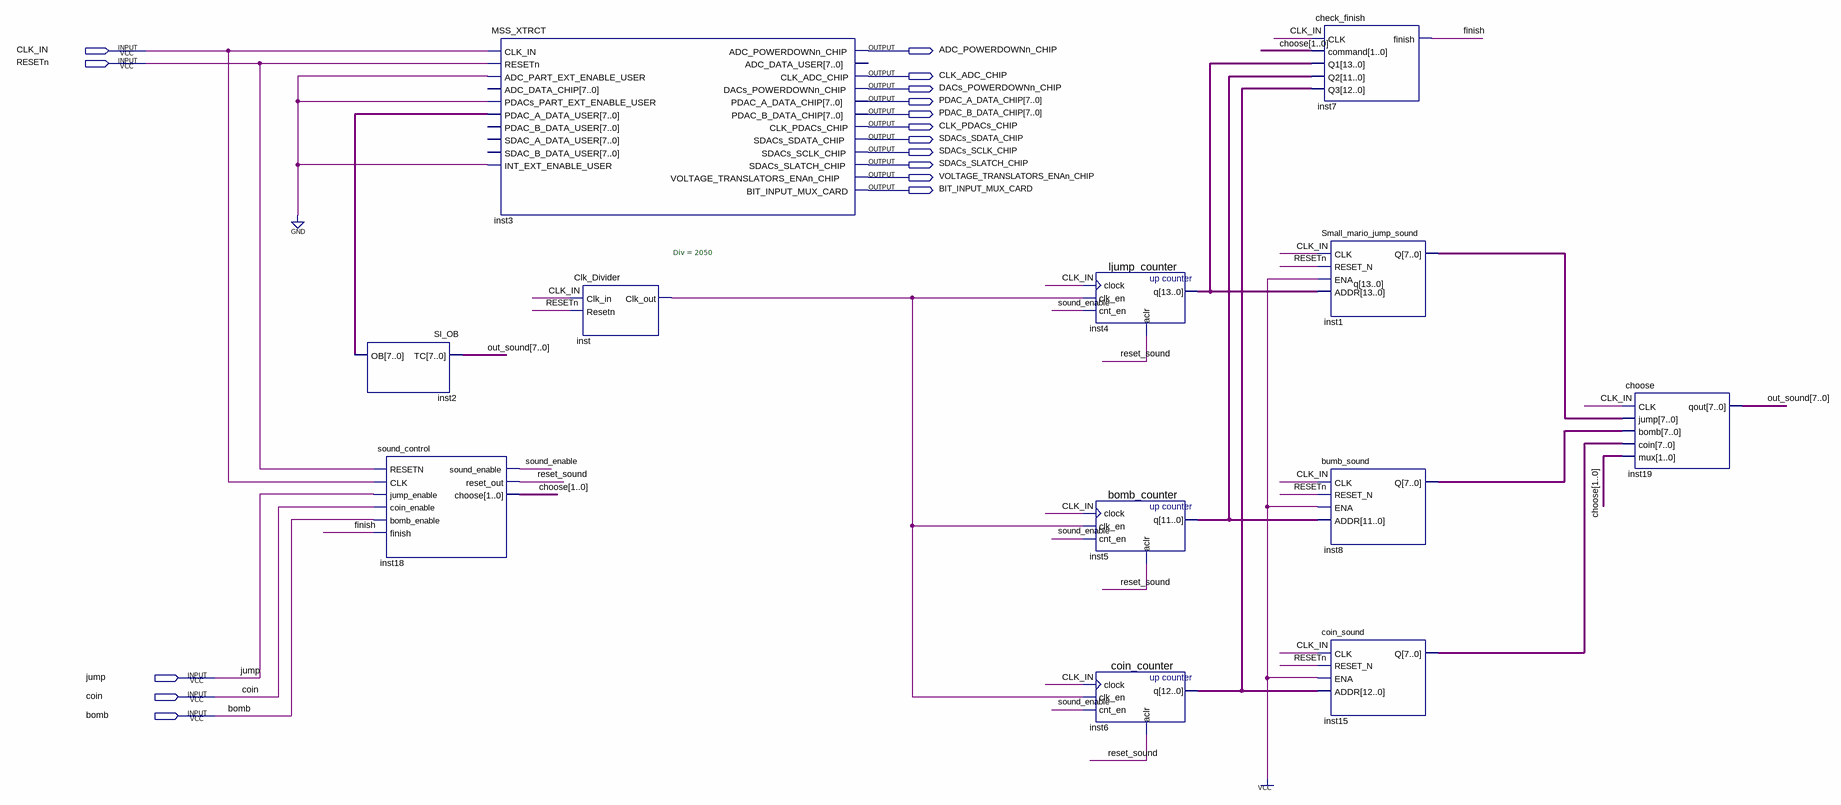
[diagram p0: schematic sheet]
// Quartus schematic output_sound.bdf as structural Verilog: 12 symbols, 16 pins
module output_sound (
  input  CLK_IN,
  input  RESETn,
  input  jump,
  input  coin,
  input  bomb,
  output ADC_POWERDOWNn_CHIP,
  output CLK_ADC_CHIP,
  output DACs_POWERDOWNn_CHIP,
  output [7:0] PDAC_A_DATA_CHIP,
  output [7:0] PDAC_B_DATA_CHIP,
  output CLK_PDACs_CHIP,
  output SDACs_SDATA_CHIP,
  output SDACs_SCLK_CHIP,
  output SDACs_SLATCH_CHIP,
  output VOLTAGE_TRANSLATORS_ENAn_CHIP,
  output BIT_INPUT_MUX_CARD
);

  wire finish, inst_clk_out, reset_sound, sound_enable;
  wire [1:0] choose;
  wire [7:0] inst1_q, inst2_ob, inst8_q, inst15_q, out_sound;
  wire [11:0] inst5_q;
  wire [12:0] inst6_q;
  wire [13:0] q;

  SI_OB inst2 (.TC(out_sound), .OB(inst2_ob));
  sound_control inst18 (
    .RESETN(RESETn), .CLK(CLK_IN), .jump_enable(jump), .coin_enable(coin), .bomb_enable(bomb),
    .finish(finish), .sound_enable(sound_enable), .reset_out(reset_sound), .choose(choose));
  MSS_XTRCT inst3 (
    .CLK_IN(CLK_IN), .RESETn(RESETn), .ADC_PART_EXT_ENABLE_USER(1'b0), .PDACs_PART_EXT_ENABLE_USER(1'b0),
    .PDAC_A_DATA_USER(inst2_ob), .INT_EXT_ENABLE_USER(1'b0), .ADC_POWERDOWNn_CHIP(ADC_POWERDOWNn_CHIP),
    .CLK_ADC_CHIP(CLK_ADC_CHIP), .DACs_POWERDOWNn_CHIP(DACs_POWERDOWNn_CHIP),
    .PDAC_A_DATA_CHIP(PDAC_A_DATA_CHIP), .PDAC_B_DATA_CHIP(PDAC_B_DATA_CHIP),
    .CLK_PDACs_CHIP(CLK_PDACs_CHIP), .SDACs_SDATA_CHIP(SDACs_SDATA_CHIP), .SDACs_SCLK_CHIP(SDACs_SCLK_CHIP),
    .SDACs_SLATCH_CHIP(SDACs_SLATCH_CHIP), .VOLTAGE_TRANSLATORS_ENAn_CHIP(VOLTAGE_TRANSLATORS_ENAn_CHIP),
    .BIT_INPUT_MUX_CARD(BIT_INPUT_MUX_CARD));  // open: ADC_DATA_CHIP, PDAC_B_DATA_USER, SDAC_A_DATA_USER, SDAC_B_DATA_USER, ADC_DATA_USER
  Clk_Divider #(.Div(2050)) inst (.Clk_in(CLK_IN), .Resetn(RESETn), .Clk_out(inst_clk_out));
  ljump_counter inst4 (.clock(CLK_IN), .clk_en(inst_clk_out), .cnt_en(sound_enable), .aclr(reset_sound), .q(q));
  bomb_counter inst5 (.clock(CLK_IN), .clk_en(inst_clk_out), .cnt_en(sound_enable), .aclr(reset_sound), .q(inst5_q));
  coin_counter inst6 (.clock(CLK_IN), .clk_en(inst_clk_out), .cnt_en(sound_enable), .aclr(reset_sound), .q(inst6_q));
  check_finish inst7 (.CLK(CLK_IN), .command(choose), .Q1(q), .Q2(inst5_q), .Q3(inst6_q), .finish(finish));
  Small_mario_jump_sound inst1 (.CLK(CLK_IN), .RESET_N(RESETn), .ENA(1'b1), .ADDR(q), .Q(inst1_q));
  bumb_sound inst8 (.CLK(CLK_IN), .RESET_N(RESETn), .ENA(1'b1), .ADDR(inst5_q), .Q(inst8_q));
  coin_sound inst15 (.CLK(CLK_IN), .RESET_N(RESETn), .ENA(1'b1), .ADDR(inst6_q), .Q(inst15_q));
  choose inst19 (.CLK(CLK_IN), .jump(inst1_q), .bomb(inst8_q), .coin(inst15_q), .mux(choose), .qout(out_sound));
endmodule
